# EasyEDA schematic 1-Schematic_USB-C Serial.json
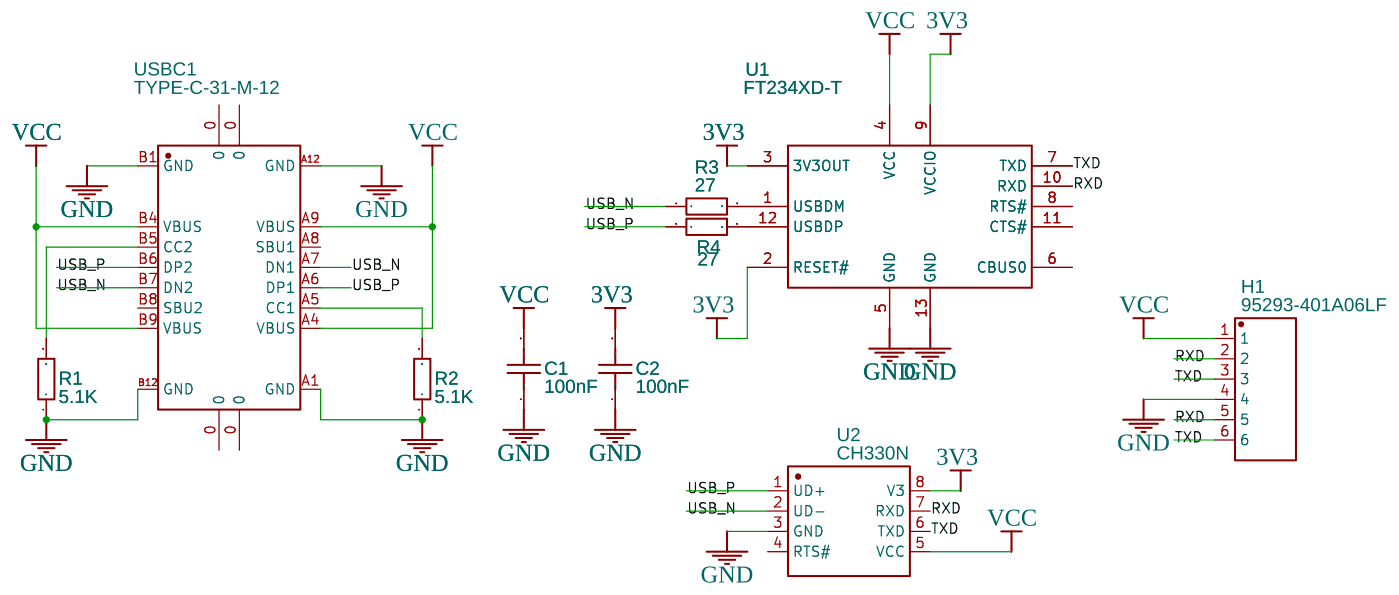
[diagram p0: schematic sheet]

## Parts
C1  100nF  [0603]
C2  100nF  [0603]
H1  95293-401A06LF  [95293-401A06LF]
R1  5.1K  [0603]
R2  5.1K  [0603]
R3  27  [0402]
R4  27  [0402]
U1  FT234XD-T  [DFN-12_13PIN-L3.00-W3.00-PITCH0.45-EP-BR]
U2  CH330N  [SOP-8_150MIL]
USBC1  TYPE-C-31-M-12  [USB-TYPE-C_16PIN-MALE-TYPE-C-31-M-12]

## Library data of the parts
C1 C2 = CC0603KRX7R9BB104: Supplier: LCSC; Manufacturer: YAGEO; LCSC Assembly: Yes; Supplier Part: C14663; SMT Type: Basic
H1 = -: Supplier: LCSC; Supplier Part: C178297; Manufacturer: Amphenol ICC; Contributor: LCSC
R1 R2 = TC0325F5101T5E: Supplier: LCSC; Manufacturer: UniOhm; Contributor: LCSC; Supplier Part: C146211; LCSC Assembly: Yes; SMT Type: Extend
R3 R4 = 0603WAF270JT5E: Supplier: LCSC; Manufacturer: UniOhm; LCSC Assembly: Yes; Supplier Part: C25190; SMT Type: Basic
U1 = -: Supplier: LCSC; Manufacturer: FTDI; Supplier Part: C89606
U2 = -: Supplier: LCSC; Manufacturer: WCH; Supplier Part: C108996
USBC1 = -: Supplier: LCSC; Supplier Part: C165948; Manufacturer: Rectangular Connectors - Contacts; Contributor: LCSC

## Nets
3V3: C2.2 U1.2(RESET#) U1.3(3V3OUT) U1.9(VCCIO) U2.8(V3)
GND: C1.1 C2.1 H1.4 R1.1 R2.1 U1.5(GND) U1.13(GND) U2.3(GND) USBC1.A1(GND) USBC1.A12(GND) USBC1.B1(GND) USBC1.B12(GND)
VCC: C1.2 H1.1 U1.4(VCC) U2.5(VCC) USBC1.A4(VBUS) USBC1.A9(VBUS) USBC1.B4(VBUS) USBC1.B9(VBUS)
RXD: H1.2 H1.5 U1.10(RXD) U2.7(RXD)
TXD: H1.3 H1.6 U1.7(TXD) U2.6(TXD)
USB_N: R3.1 U2.2(UD-) USBC1.A7(DN1) USBC1.B7(DN2)
USB_P: R4.1 U2.1(UD+) USBC1.A6(DP1) USBC1.B6(DP2)
Net-(R1-2): R1.2 USBC1.B5(CC2)
Net-(R2-2): R2.2 USBC1.A5(CC1)
Net-(R3-2): R3.2 U1.1(USBDM)
Net-(R4-2): R4.2 U1.12(USBDP)

Not connected (* = marked no-connect by the designer): U1 6(CBUS0) 8(RTS#) 11(CTS#); U2 4(RTS#); USBC1 0 A8(SBU1) B8(SBU2)
